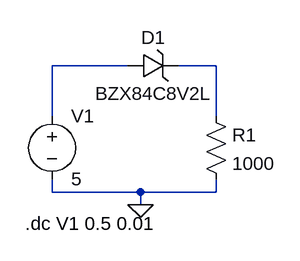
[diagram p0: schematic zener diode foeward biased.asc]
zener diode foeward biased.asc, the LTspice schematic file:
Version 4
SHEET 1 880 680
WIRE 160 80 64 80
WIRE 272 80 224 80
WIRE 64 144 64 80
WIRE 272 144 272 80
WIRE 64 240 64 224
WIRE 176 240 64 240
WIRE 272 240 272 224
WIRE 272 240 176 240
WIRE 176 256 176 240
FLAG 176 256 0
SYMBOL zener 160 96 R270
WINDOW 0 36 32 VTop 2
WINDOW 3 -4 32 VBottom 2
SYMATTR InstName D1
SYMATTR Value BZX84C8V2L
SYMBOL res 256 128 R0
SYMATTR InstName R1
SYMATTR Value 1000
SYMBOL voltage 64 128 R0
WINDOW 123 0 0 Left 0
WINDOW 39 0 0 Left 0
SYMATTR InstName V1
SYMATTR Value 5
TEXT 30 280 Left 2 !.dc V1 0.5 0.01

The netlist it stands for:
* zener diode foeward biased.asc
D1 N001 N002 BZX84C8V2L
R1 N002 0 1000
V1 N001 0 5
.model D D
.lib standard.dio
.dc V1 0.5 0.01
.backanno
.end